# EAGLE schematic final_enclosure_wiring (EAGLE 8.0.1)
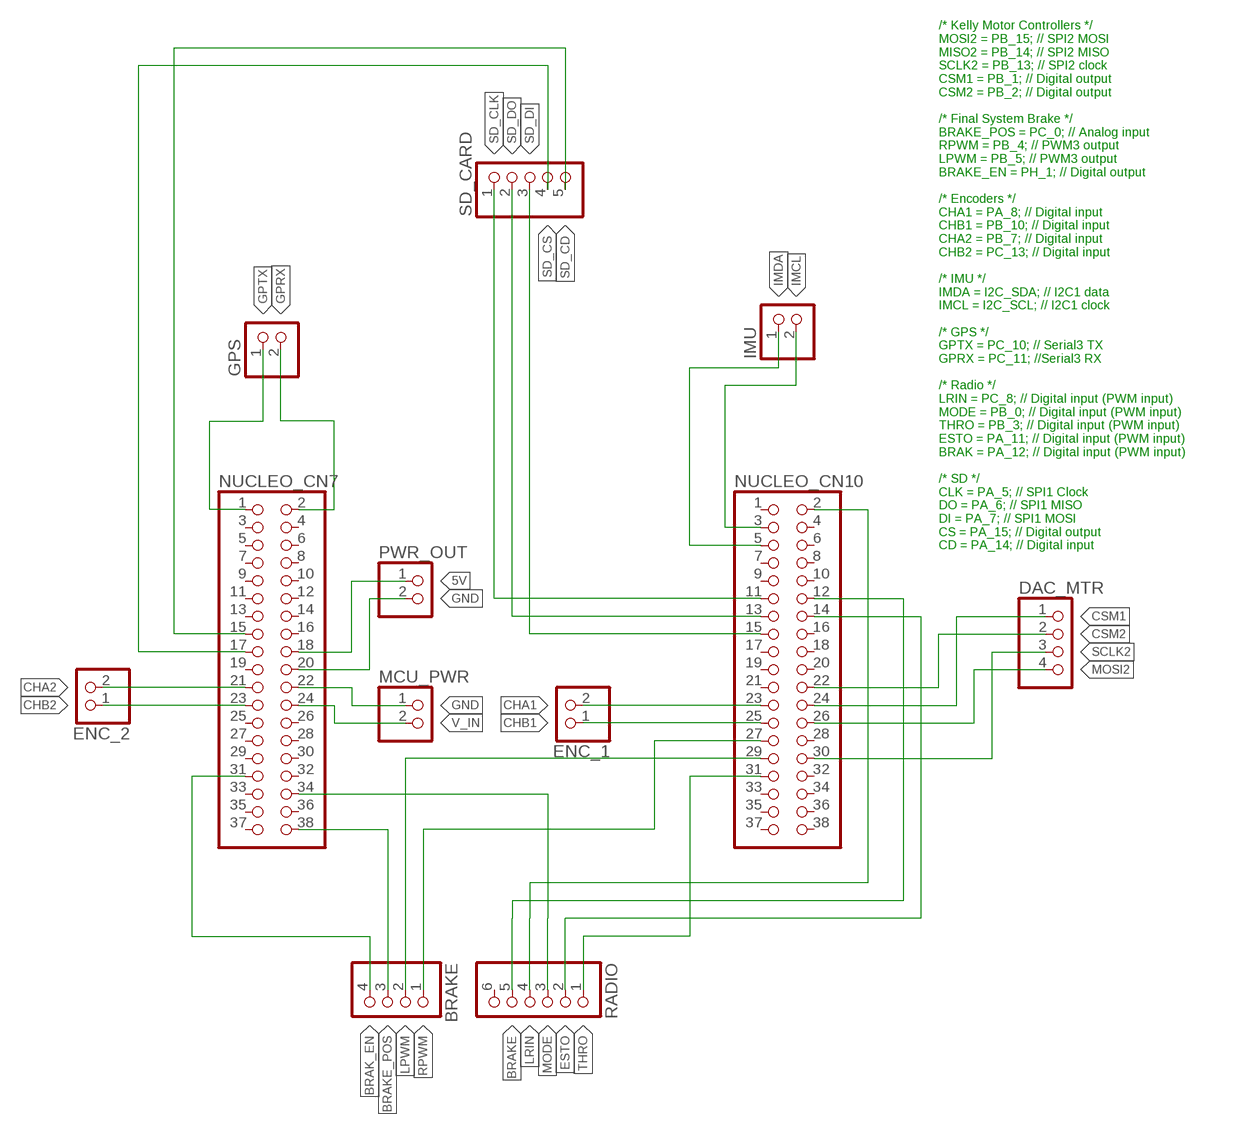
[diagram p0: schematic, sheet 1]

## Parts
BRAKE  PINHD-1X4  [1X04]
DAC_MTR  PINHD-1X4  [1X04]
ENC_1  PINHD-1X2  [1X02]
ENC_2  PINHD-1X2  [1X02]
GPS  PINHD-1X2  [1X02]
IMU  PINHD-1X2  [1X02]
MCU_PWR  PINHD-1X2  [1X02]
NUCLEO_CN7  PINHD-2X19  [2X19]
NUCLEO_CN10  PINHD-2X19  [2X19]
PWR_OUT  PINHD-1X2  [1X02]
RADIO  PINHD-1X6  [1X06]
SD_CARD  PINHD-1X5  [1X05]

## Nets
5V: NUCLEO_CN7.18 PWR_OUT.1
BRAK_EN: BRAKE.4 NUCLEO_CN7.31
BRAKE: NUCLEO_CN10.12 RADIO.5
BRAKE_POS: BRAKE.3 NUCLEO_CN7.38
CHA1: ENC_1.2 NUCLEO_CN10.23
CHA2: ENC_2.2 NUCLEO_CN7.21
CHB1: ENC_1.1 NUCLEO_CN10.25
CHB2: ENC_2.1 NUCLEO_CN7.23
CSM1: DAC_MTR.1 NUCLEO_CN10.24
CSM2: DAC_MTR.2 NUCLEO_CN10.22
ESTO: NUCLEO_CN10.14 RADIO.2
GND: MCU_PWR.1 NUCLEO_CN7.20 NUCLEO_CN7.22 PWR_OUT.2
GPRX: GPS.2 NUCLEO_CN7.2
GPTX: GPS.1 NUCLEO_CN7.1
IMCL: IMU.2 NUCLEO_CN10.3
IMDA: IMU.1 NUCLEO_CN10.5
LPWM: BRAKE.2 NUCLEO_CN10.29
LRIN: NUCLEO_CN10.2 RADIO.4
MODE: NUCLEO_CN7.34 RADIO.3
MOSI2: DAC_MTR.4 NUCLEO_CN10.26
RPWM: BRAKE.1 NUCLEO_CN10.27
SCLK2: DAC_MTR.3 NUCLEO_CN10.30
SD_CD: NUCLEO_CN7.15 SD_CARD.5
SD_CLK: NUCLEO_CN10.11 SD_CARD.1
SD_CS: NUCLEO_CN7.17 SD_CARD.4
SD_DI: NUCLEO_CN10.15 SD_CARD.3
SD_DO: NUCLEO_CN10.13 SD_CARD.2
THRO: NUCLEO_CN10.31 RADIO.1
V_IN: MCU_PWR.2 NUCLEO_CN7.24
Unconnected: NUCLEO_CN7.3 NUCLEO_CN7.4 NUCLEO_CN7.5 NUCLEO_CN7.6 NUCLEO_CN7.7 NUCLEO_CN7.8 NUCLEO_CN7.9 NUCLEO_CN7.10 NUCLEO_CN7.11 NUCLEO_CN7.12 NUCLEO_CN7.13 NUCLEO_CN7.14 NUCLEO_CN7.16 NUCLEO_CN7.19 NUCLEO_CN7.25 NUCLEO_CN7.26 NUCLEO_CN7.27 NUCLEO_CN7.28 NUCLEO_CN7.29 NUCLEO_CN7.30 NUCLEO_CN7.32 NUCLEO_CN7.33 NUCLEO_CN7.35 NUCLEO_CN7.36 NUCLEO_CN7.37 NUCLEO_CN10.1 NUCLEO_CN10.4 NUCLEO_CN10.6 NUCLEO_CN10.7 NUCLEO_CN10.8 NUCLEO_CN10.9 NUCLEO_CN10.10 NUCLEO_CN10.16 NUCLEO_CN10.17 NUCLEO_CN10.18 NUCLEO_CN10.19 NUCLEO_CN10.20 NUCLEO_CN10.21 NUCLEO_CN10.28 NUCLEO_CN10.32 NUCLEO_CN10.33 NUCLEO_CN10.34 NUCLEO_CN10.35 NUCLEO_CN10.36 NUCLEO_CN10.37 NUCLEO_CN10.38 RADIO.6

## Notes on the sheet
- /* Kelly Motor Controllers */
  MOSI2 = PB_15; // SPI2 MOSI
  MISO2 = PB_14; // SPI2 MISO
  SCLK2 = PB_13; // SPI2 clock
  CSM1 = PB_1; // Digital output
  CSM2 = PB_2; // Digital output
  
  /* Final System Brake */
  BRAKE_POS = PC_0; // Analog input
  RPWM = PB_4; // PWM3 output
  LPWM = PB_5; // PWM3 output
  BRAKE_EN = PH_1; // Digital output
  
  /* Encoders */
  CHA1 = PA_8; // Digital input
  CHB1 = PB_10; // Digital input
  CHA2 = PB_7; // Digital input
  CHB2 = PC_13; // Digital input
  
  /* IMU */
  IMDA = I2C_SDA; // I2C1 data
  IMCL = I2C_SCL; // I2C1 clock
  
  /* GPS */
  GPTX = PC_10; // Serial3 TX
  GPRX = PC_11; //Serial3 RX
  
  /* Radio */
  LRIN = PC_8; // Digital input (PWM input)
  MODE = PB_0; // Digital input (PWM input)
  THRO = PB_3; // Digital input (PWM input)
  ESTO = PA_11; // Digital input (PWM input)
  BRAK = PA_12; // Digital input (PWM input)
  
  /* SD */
  CLK = PA_5; // SPI1 Clock
  DO = PA_6; // SPI1 MISO
  DI = PA_7; // SPI1 MOSI
  CS = PA_15; // Digital output
  CD = PA_14; // Digital input

## Library data of the parts
BRAKE DAC_MTR = pinhead:PINHD-1X4: PIN HEADER
ENC_1 ENC_2 GPS IMU MCU_PWR PWR_OUT = pinhead:PINHD-1X2: PIN HEADER
NUCLEO_CN7 NUCLEO_CN10 = pinhead:PINHD-2X19: PIN HEADER
RADIO = pinhead:PINHD-1X6: PIN HEADER
SD_CARD = pinhead:PINHD-1X5: PIN HEADER